# EAGLE design badge2012 (EAGLE 6.2)
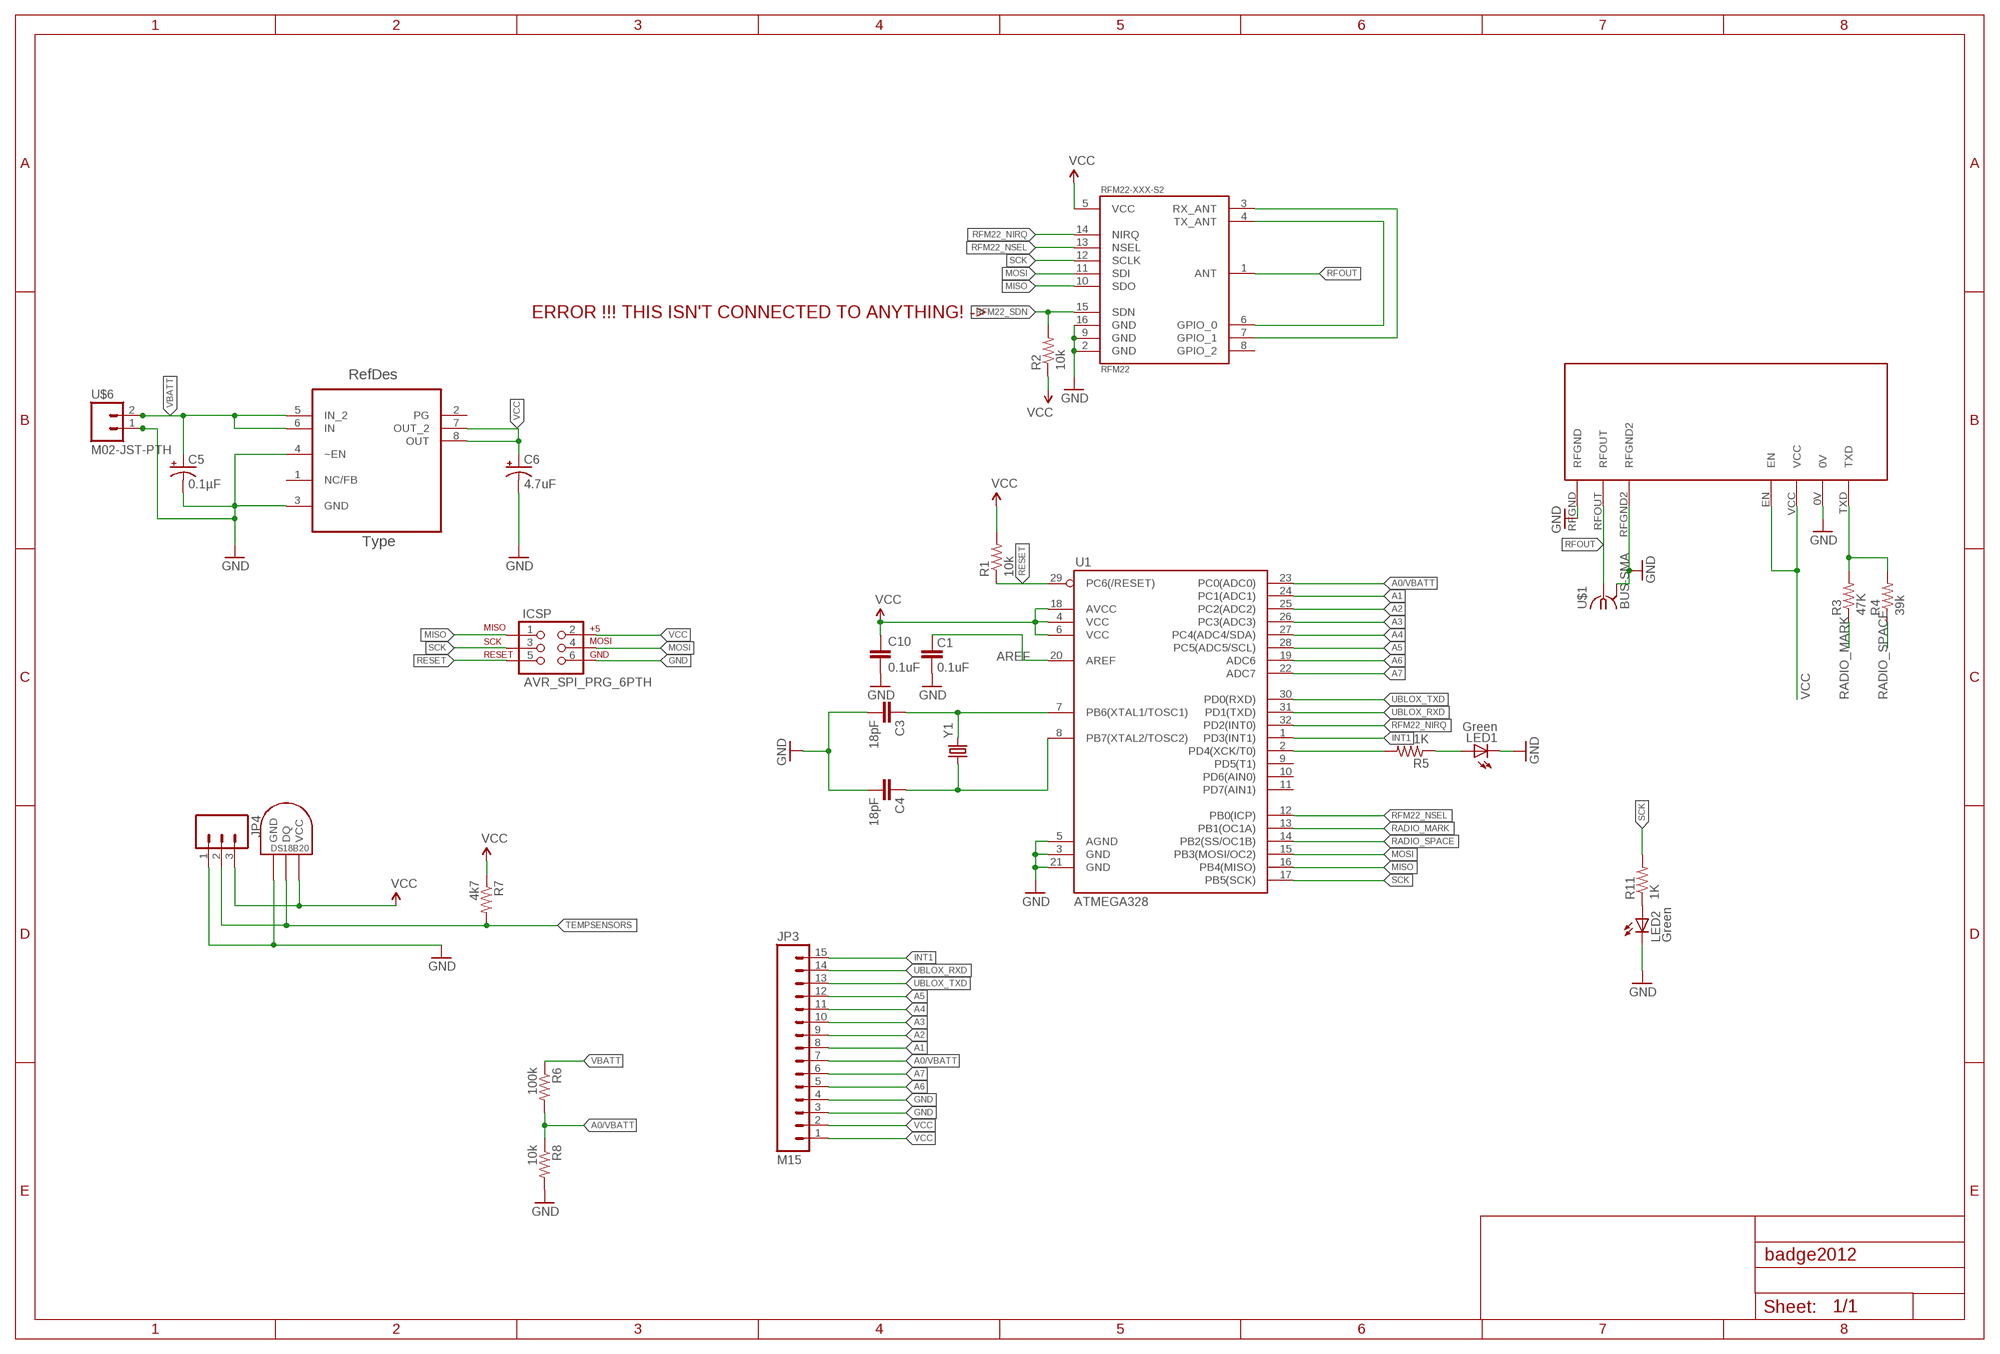
[diagram p0: schematic, sheet 1]

## Parts
C1  0.1uF  CAP0603-CAP  [0603-CAP]
C3  18pF  CAP0603-CAP  [0603-CAP]
C4  18pF  CAP0603-CAP  [0603-CAP]
C5  0.1µF  CAP_POL1206-KIT  [EIA3216-KIT]
C6  4.7uF  CAP_POL1206-KIT  [EIA3216-KIT]
C10  0.1uF  CAP0603-CAP  [0603-CAP]
ICSP  AVR_SPI_PRG_6PTH  [2X3]
JP3  M15  [1X15]
JP4  M03PTH  [1X03]
LED1  Green  LED0603  [LED-0603]
LED2  Green  LED0603  [LED-0603]
NTX2TEMP  DS1821  DS1820SOIC  [DS18B20_SOIC]
R1  10k  RESISTOR0603-RES  [0603-RES]
R2  10k  RESISTOR0603-RES  [0603-RES]
R3  47K  RESISTOR0603-RES  [0603-RES]
R4  39k  RESISTOR0603-RES  [0603-RES]
R5  1K  RESISTOR0603-RES  [0603-RES]
R6  100k  RESISTOR0603-RES  [0603-RES]
R7  4k7  RESISTOR0603-RES  [0603-RES]
R8  10k  RESISTOR0603-RES  [0603-RES]
R11  1K  RESISTOR0603-RES  [0603-RES]
RFM22-XXX-S2  RFM22  [RFM22-XXX-S2]
U1  ATMEGA328  ATMEGA168  [TQFP32-08]
U2  TPS76633D  [SOIC127P600X175-8N]
U$1  BUS-SMA  [BUS-SMA]
U$4  NTX2  [NTX2]
U$6  M02-JST-PTH  [M02-JST-PTH]
Y1  CRYSTALSMD  [HC49UP]

## Nets
A0/VBATT [vcc]: JP3.7 R6.2 R8.1 U1.23(PC0(ADC0))
A1: JP3.8 U1.24(PC1(ADC1))
A2: JP3.9 U1.25(PC2(ADC2))
A3: JP3.10 U1.26(PC3(ADC3))
A4: JP3.11 U1.27(PC4(ADC4/SDA))
A5: JP3.12 U1.28(PC5(ADC5/SCL))
A6: JP3.5 U1.19(ADC6)
A7: JP3.6 U1.22(ADC7)
AREF: C1.2 U1.20(AREF)
GND [vcc]: C1.1 C3.2 C4.2 C5.C(-) C6.C(-) C10.2 ICSP.6 JP3.3 JP3.4 JP4.1 LED1.C LED2.C NTX2TEMP.GND R8.2 RFM22-XXX-S2.2(GND) RFM22-XXX-S2.9(GND) RFM22-XXX-S2.16(GND) U1.3(GND) U1.5(AGND) U1.21(GND) U2.3(GND) U2.4(~EN) U$1.2(GND) U$1.3(GND) U$1.4(GND) U$1.5(GND) U$4.0V U$4.RFGND U$4.RFGND2 U$6.1
INT1: JP3.15 U1.1(PD3(INT1))
MISO: ICSP.1 RFM22-XXX-S2.10(SDO) U1.16(PB4(MISO))
MOSI: ICSP.4 RFM22-XXX-S2.11(SDI) U1.15(PB3(MOSI/OC2))
N$1: R5.2 U1.2(PD4(XCK/T0))
N$2: R3.2 R4.2 U$4.TXD
N$3: LED1.A R5.1
N$5: RFM22-XXX-S2.3(RX_ANT) RFM22-XXX-S2.7(GPIO_1)
N$6: RFM22-XXX-S2.4(TX_ANT) RFM22-XXX-S2.6(GPIO_0)
N$8: LED2.A R11.1
N$9: C3.1 U1.7(PB6(XTAL1/TOSC1)) Y1.2
N$10: C4.1 U1.8(PB7(XTAL2/TOSC2)) Y1.1
RADIO_MARK: R3.1 U1.13(PB1(OC1A))
RADIO_SPACE: R4.1 U1.14(PB2(SS/OC1B))
RESET: ICSP.5 R1.1 U1.29(PC6(/RESET))
RFM22_NIRQ: RFM22-XXX-S2.14(NIRQ) U1.32(PD2(INT0))
RFM22_NSEL: RFM22-XXX-S2.13(NSEL) U1.12(PB0(ICP))
RFM22_SDN: R2.2 RFM22-XXX-S2.15(SDN)
RFOUT: RFM22-XXX-S2.1(ANT) U$1.1 U$4.RFOUT
SCK: ICSP.3 R11.2 RFM22-XXX-S2.12(SCLK) U1.17(PB5(SCK))
TEMPSENSORS: JP4.2 NTX2TEMP.DQ R7.2
UBLOX_RXD: JP3.14 U1.31(PD1(TXD))
UBLOX_TXD: JP3.13 U1.30(PD0(RXD))
VBATT [vcc]: C5.A(+) R6.1 U2.5(IN_2) U2.6(IN) U$6.2
VCC: C6.A(+) C10.1 ICSP.2 JP3.1 JP3.2 JP4.3 NTX2TEMP.VCC R1.2 R2.1 R7.1 RFM22-XXX-S2.5(VCC) U1.4(VCC) U1.6(VCC) U1.18(AVCC) U2.7(OUT_2) U2.8(OUT) U$4.EN U$4.VCC
Unconnected: RFM22-XXX-S2.8(GPIO_2) U1.9(PD5(T1)) U1.10(PD6(AIN0)) U1.11(PD7(AIN1)) U2.1(NC/FB) U2.2(PG)

## Notes on the sheet
- ERROR !!! THIS ISN'T CONNECTED TO ANYTHING! ->

## Library data of the parts
C1 C3 C4 C10 = SparkFun:CAP: Capacitor Standard 0603 ceramic capacitor, and 0.1" leaded capacitor.
C5 C6 = SparkFun:CAP_POL: Capacitor Polarized These are standard SMD and PTH capacitors. Normally 10uF, 47uF, and 100uF in electrolytic and tantalum varieties. Always verify the external diameter of the through hole cap, it varies with capacity, voltage, and manufacturer. The EIA devices should be standard.
ICSP = SparkFun:AVR_SPI_PRG_6: AVR ISP 6 Pin This is the reduced ISP connector for AVR programming. Common on Arduino. This footprint will take up less PCB space and can be used with a 10-pin to 6-pin adapter such as SKU: BOB-08508
JP3 = SparkFun:M15: Header 15 Standard 15-pin 0.1" header. Use with straight break away headers (SKU : PRT-00116), right angle break away headers (PRT-00553), swiss pins (PRT-00743), machine pins (PRT-00117), and female headers (PRT-00115).
JP4 = SparkFun:M03: Header 3 Standard 3-pin 0.1" header. Use with straight break away headers (SKU : PRT-00116), right angle break away headers (PRT-00553), swiss pins (PRT-00743), machine pins (PRT-00117), and female headers (PRT-00115). Molex polarized connector foot print use with SKU : PRT-08232 with associated crimp pins and housings.
LED1 LED2 = SparkFun:LED: LEDs Standard schematic elements and footprints for 5mm, 3mm, 1206, and 0603 sized LEDs. 5mm - Spark Fun Electronics SKU : COM-00529 (and others)
NTX2TEMP = ava:DS1820: DS18B20 Programmable Resolution 1-Wire Digital Thermometer Description The DS18B20 digital thermometer provides 9-bit to 12-bit Celsius temperature measurements and has an alarm function with nonvolatile user-programmable upper and lower trigger points. The DS18B20 communicates over a 1-Wire® bus that by definition requires only one data line (and ground) for communication with a central microprocessor. It has an operating temperature range of -55°C to +125°C and is accurate to ±0.5°C over the range of -10°C to +85°C. In addition, the DS18B20 can derive power directly from the data line ("parasite power"), eliminating the need for an external power supply. Each DS18B20 has a unique 64-bit serial code, which allows multiple DS18B20s to function on the same 1-Wire bus. Thus, it is simple to use one microprocessor to control many DS18B20s distributed over a large area. Applications that can benefit from this feature include HVAC environmental controls, temperature monitoring systems inside buildings, equipment, or machinery, and process monitoring and control systems.
R1-R8 R11 = SparkFun:RESISTOR: Resistor Basic schematic elements and footprints for 0603, 1206, and PTH resistors.
RFM22-XXX-S2 = SparkFun:RFM22: *Hope RF's RFM22* Packages: RFM22-S2 (SMD)
U1 = SparkFun:ATMEGA168
U2 = ava:TPS76633D; DESCRIPTION: ULTRALOW QUIESCENT CURRENT 250-mA LOW DROPOUT VOLTAGE REGULATORS; MPN: TPS76633D; OC_FARNELL: 8461422; OC_NEWARK: 77C1060; PACKAGE: SOIC-8; SUPPLIER: Texas Instruments
U$1 = ava:BUS-SMA
U$4 = ava:NTX2: Radiometrix NTX2 Transmitter Module Author Anthony Stirk / http://ava.upuaut.net
U$6 = ava:M02-JST-PTH
Y1 = SparkFun:CRYSTAL: Crystals Various standard crystals. Proven footprints. Spark Fun Electronics SKU : COM-00534

## Net classes
0 default: width 0.203 mm
1 vcc: width 0.254 mm

## Board
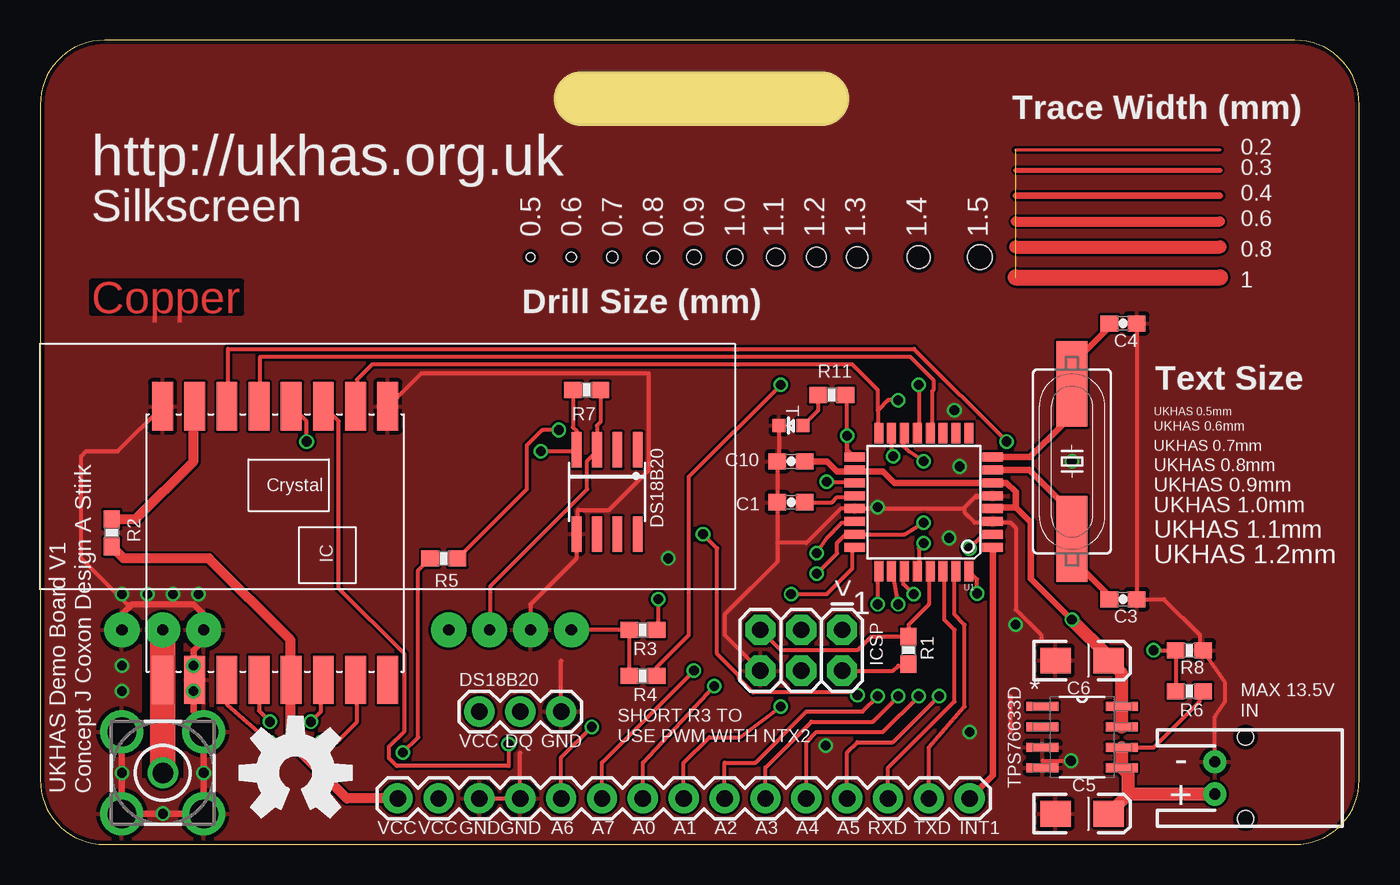
[diagram p1: board, top side]
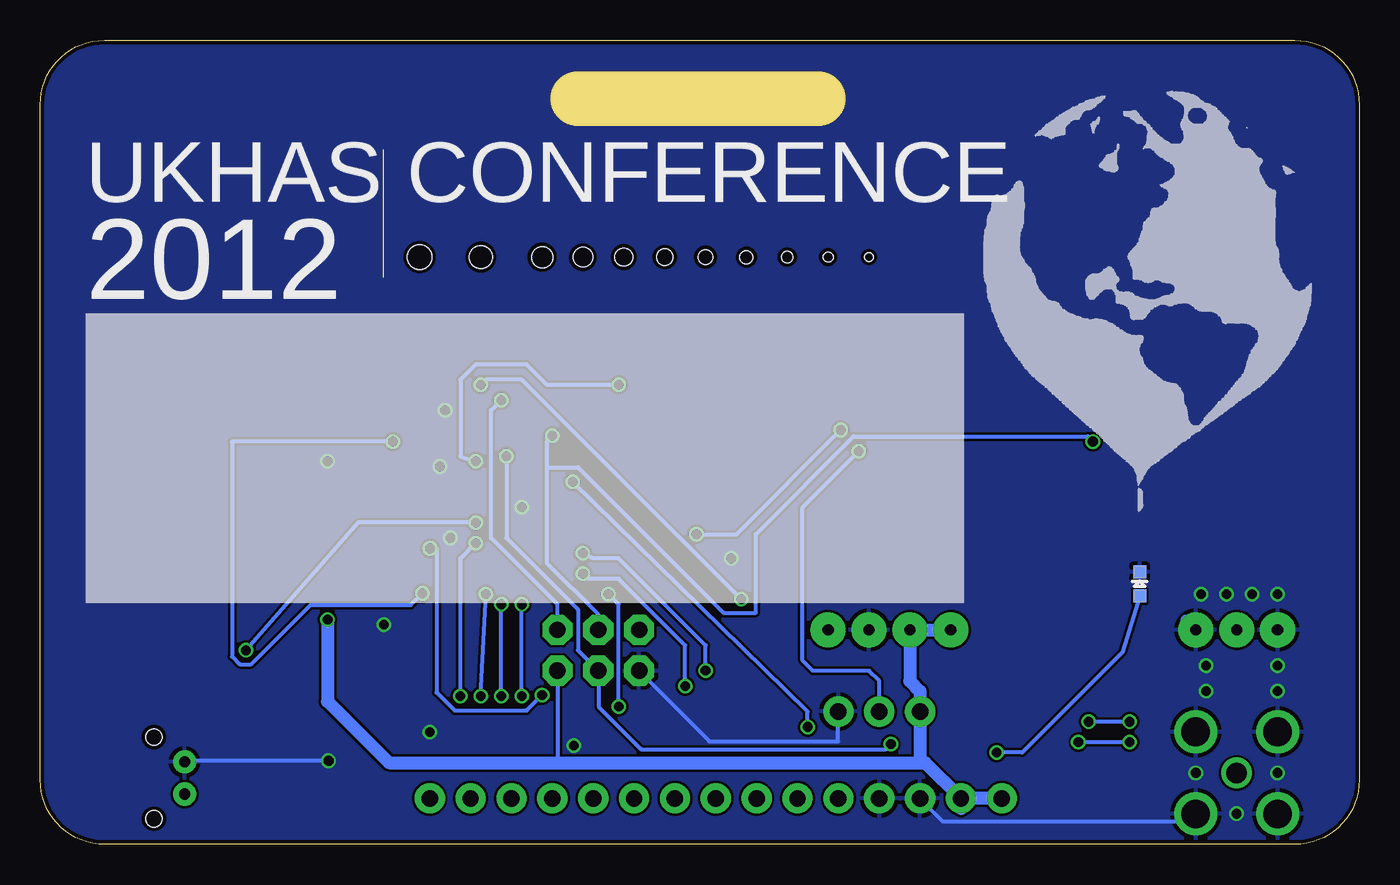
[diagram p2: board, bottom side, seen from below]

Size 82 x 50 mm. Coordinates in mm from the lower left corner, seen from the top.
Outline: 82,4 82,46 arc90 78,50 4,50 arc90 0,46 0,4 arc90 4,0 78,0 arc90 82,4
Copper layers (1*16): Top 0.035mm / dielectric 1.5mm / Bottom 0.035mm
Design rules: minimum track width 6mil, minimum drill 12mil, track to track 6mil, track to pad 6mil, pad to pad 6mil, via to via 6mil, smd to smd 0mil, copper to edge 10mil, drill to drill 10mil, minimum pad ring 10mil, minimum via ring 6mil, stop-mask expansion 2mil, vias tented up to drill 100mil, thermal gap 10mil
Holes 0.5 mm at 30.48,36.51
Holes 0.6 mm at 33.02,36.51
Holes 0.7 mm at 35.56,36.51
Holes 0.8 mm at 38.1,36.51
Holes 0.9 mm at 40.64,36.51
Holes 1 mm at 43.18,36.51
Holes 1.1 mm at 45.72,36.51
Holes 1.2 mm at 48.26,36.51
Holes 1.3 mm at 50.8,36.51
Holes 1.4 mm at 54.61,36.51
Holes 1.5 mm at 58.42,36.51
tRestrict: area 6.3,4.1 to 8.9,13.3
Milling: 1 lines

### Footprints (pad centres in the part's own frame; a part is rotated, then mirrored left to right if it is on the bottom)
0603-CAP = smd 1.1 x 1: 1 -0.85,0; 2 0.85,0
EIA3216-KIT = smd 1.9 x 1.6: A 1.65,0; C -1.65,0
2X3 = drill 1.016 pad 1.88 octagon: 1 0,0; 2 0,2.54; 3 2.54,0; 4 2.54,2.54; 5 5.08,0; 6 5.08,2.54
1X15 = drill 1.016 pad 1.88: 1 0,0; 2 2.54,0; 3 5.08,0; 4 7.62,0; 5 10.16,0; 6 12.7,0; 7 15.24,0; 8 17.78,0; 9 20.32,0; 10 22.86,0; 11 25.4,0; 12 27.94,0; 13 30.48,0; 14 33.02,0; 15 35.56,0
1X03 = drill 1.016 pad 1.88: 1 0,0; 2 2.54,0; 3 5.08,0
LED-0603 = smd 0.8 x 0.8: A 0,-0.75; C 0,0.75
DS18B20_SOIC = smd 0.61 x 2.21: DQ 1.905,-2.616; GND 1.905,2.616; NC -1.905,-2.616; NC2 -0.635,-2.616; NC3 -1.905,2.616; NC4 -0.635,2.616; NC5 0.635,2.616; VCC 0.635,-2.616
0603-RES = smd 1.1 x 1: 1 -0.85,0; 2 0.85,0
RFM22-XXX-S2 = smd 3 x 1.3: 1 -8.5,7; 2 -8.5,5; 3 -8.5,3; 4 -8.5,1; 5 -8.5,-1; 6 -8.5,-3; 7 -8.5,-5; 8 -8.5,-7; 9 8.5,-7; 10 8.5,-5; 11 8.5,-3; 12 8.5,-1; 13 8.5,1; 14 8.5,3; 15 8.5,5; 16 8.5,7
TQFP32-08 = smd 1.27 x 0.559: 1 -4.293,2.8; 2 -4.293,2; 3 -4.293,1.2; 4 -4.293,0.4; 5 -4.293,-0.4; 6 -4.293,-1.2; 7 -4.293,-2; 8 -4.293,-2.8; 17 4.293,-2.8; 18 4.293,-2; 19 4.293,-1.2; 20 4.293,-0.4; 21 4.293,0.4; 22 4.293,1.2; 23 4.293,2; 24 4.293,2.8 | smd 0.559 x 1.27: 9 -2.8,-4.293; 10 -2,-4.293; 11 -1.2,-4.293; 12 -0.4,-4.293; 13 0.4,-4.293; 14 1.2,-4.293; 15 2,-4.293; 16 2.8,-4.293; 25 2.8,4.293; 26 2,4.293; 27 1.2,4.293; 28 0.4,4.293; 29 -0.4,4.293; 30 -1.2,4.293; 31 -2,4.293; 32 -2.8,4.293
SOIC127P600X175-8N = smd 1.981 x 0.559: 1 -2.464,1.905; 2 -2.464,0.635; 3 -2.464,-0.635; 4 -2.464,-1.905; 5 2.464,-1.905; 6 2.464,-0.635; 7 2.464,0.635; 8 2.464,1.905
BUS-SMA = drill 1.27: 1 0,0 | drill 1.778: 2 -2.55,2.55; 3 2.55,2.55; 4 2.55,-2.55; 5 -2.55,-2.55
NTX2 = drill 0.7 pad 2.184: 0V -2.54,-10.16; EN -7.62,-10.16; RFGND -22.86,-10.16; RFGND2 -27.94,-10.16; RFOUT -25.4,-10.16; TXD 0,-10.16; VCC -5.08,-10.16
M02-JST-PTH = drill 0.7 pad 1.448: 1 -1,0; 2 1,0 | hole 1: -2.54,1.905; 2.54,1.905
HC49UP = smd 5.334 x 1.93: 1 -4.826,0; 2 4.826,0

### Placement (x,y rotation side)
C1  46.67,21.27 0 top
C3  67.31,15.24 0 top
C4  67.31,32.38 0 top
C5  64.77,1.91 0 top
C6  64.77,11.43 0 top
C10  46.67,23.81 180 top
ICSP  49.85,13.34 180 top
JP3  22.23,2.86 0 top
JP4  32.38,8.26 180 top
LED1  13.65,16.19 0 bottom
LED2  46.67,26.04 90 top
NTX2TEMP  35.24,21.91 180 top
R1  53.98,12.06 270 top
R2  4.45,19.37 90 top
R3  37.47,13.34 180 top
R4  37.47,10.48 180 top
R5  25.08,17.78 0 top
R6  71.44,9.53 180 top
R7  33.97,28.26 180 top
R8  71.44,12.06 0 top
R11  49.21,27.94 0 top
RFM22-XXX-S2  14.61,18.73 90 top
U1  54.93,21.27 180 top
U2  64.77,6.67 0 top
U$1  7.62,4.45 0 top
U$2  [OSHW-LOGO-L]  15.88,4.45 0 top
U$4  33.02,23.5 0 top
U$6  73.03,4.13 270 top
Y1  64.14,23.81 270 top

### Tracks (layer width: path | path; a pad name or v marks a point on that pad's centre or on a via)
A0/VBATT  (via drill 0.6)
  Top 0.254: R6.2 R8.1 v69.22,12.06 | v54.93,20 53.75,19.27 U1.23 50.54,19.37 50.16,19.37 49.53,18.73 49.53,18.1 v48.26,16.83 | JP3.7 37.47,5.08 v41.91,9.84
  Bottom 0.254: v54.93,20 62.23,20 v69.22,12.06 | v41.91,9.84 41.91,12.38 46.04,16.51 47.94,16.51 v48.26,16.83
A1  (via drill 0.6)
  Top 0.254: JP3.8 40.01,5.08 41.59,6.67 43.5,6.67 v46.04,8.57 | v46.67,15.56 48.9,15.56 50.48,17.14 50.48,18.32 U1.24
  Bottom 0.254: v46.04,8.57 46.04,14.92 v46.67,15.56
A2  (via drill 0.6)
  Top 0.254: v52.07,9.21 51.12,8.26 47.62,8.26 44.45,5.08 42.55,5.08 JP3.9 | v52.07,14.92 52.07,16.92 U1.25
  Bottom 0.254: v52.07,9.21 v52.07,14.92
A3  (via drill 0.6)
  Top 0.254: JP3.10 45.09,4.76 47.94,7.62 51.75,7.62 v53.34,9.21 | v53.34,14.92 53.02,16.89 U1.26
  Bottom 0.254: v53.34,9.21 v53.34,14.92
A4  (via drill 0.6)
  Top 0.254: JP3.11 47.62,6.35 48.26,6.99 52.39,6.99 v54.61,9.21 | v54.29,15.56 53.66,16.19 53.66,16.91 U1.27
  Bottom 0.254: v54.61,9.21 v54.29,15.56
A5  (via drill 0.6)
  Top 0.254: JP3.12 50.16,5.71 50.8,6.35 53.02,6.35 v55.88,9.21 | v54.93,18.73 54.61,18.41 54.61,17.06 U1.28
  Bottom 0.254: v55.88,9.21 55.88,17.78 v54.93,18.73
A6  (via drill 0.6)
  Top 0.254: JP3.5 32.38,5.4 v34.29,7.3 | v48.9,22.54 50.56,22.54 U1.19
  Bottom 0.254: v34.29,7.3 34.29,8.26 v48.9,22.54
A7  (via drill 0.6)
  Top 0.254: JP3.6 34.92,5.08 v40.64,10.79 | v48.26,18.1 48.9,19.05 49.85,20 50.56,20 U1.22
  Bottom 0.254: v40.64,10.79 40.64,12.38 46.04,17.78 47.62,17.78 v48.26,18.1
AREF
  Top 0.254: C1.2 49.21,21.27 49.53,21.59 50.55,21.59 U1.20
GND  (via drill 0.6, 0.61)
  Top 0.254: U$6.1 73.03,7.94 73.66,8.89 73.66,10.06 72.62,11.59 | 72.62,11.59 R8.2 72.07,12.28 72.07,13.02 69.85,15.24 C3.2 C4.2 | 72.66,11.54 72.62,11.59 | LED2.C 45.92,23.91 C10.2 C1.1 45.82,18.73 | 45.82,18.73 45.82,17.57 42.55,14.29 42.55,13.02 ICSP.6 | 45.82,18.73 47.62,18.73 49.77,20.87 U1.21 57.38,20.87 57.47,20.95 | 58.1,21.59 59.14,21.59 U1.5 58.19,21.67 58.1,21.59 | 58.1,21.59 57.47,20.95 | 57.47,20.95 57.47,20.64 58.1,20 59.15,20 | 59.15,20 U1.3 | 59.15,20 60.33,20 60.64,19.68 60.64,14.61 62.23,13.02 62.23,12.7 | 62.87,12.06 62.87,11.69 C6.C 62.55,11.43 | 60.33,9.21 60.33,6.99 | 5.71,14.92 5.4,14.92 2.54,17.78 2.54,24.13 2.86,24.45 4.82,24.45 RFM22-XXX-S2.16 | JP3.3 JP3.4 29.84,5.71 | JP4.1 32.38,11.43 | U$4.0V 30.48,14.92 33.34,17.78 NTX2TEMP.GND 33.44,19.36 33.44,20.8 35.36,20.8 37.84,23.28 37.84,29.28 23.68,29.28 21.68,27.28 RFM22-XXX-S2.9 | 62.31,5.2 v64.08,5.2
  Top 0.406: U$1.2 U$1.5 U$1.4 U$1.3 10.17,7.61 9.53,8.26 9.53,10.15 RFM22-XXX-S2.2 9.53,10.31 9.53,12.06 10.16,12.7 U$4.RFGND 10.16,14.29 9.53,14.92 5.71,14.92 5.08,14.29 U$4.RFGND2
  Bottom 0.254: JP4.1 32.4,8.24 32.4,6.4 40.4,6.4 44.72,10.72 ICSP.6 | v64.08,5.2 72.96,5.2 U$6.1 | U$1.4 10.24,1.84 10.64,1.44 25.92,1.44 27.28,2.8 JP3.3
  Bottom 0.61: 10.79,13.97 U$4.RFGND
  other vias: 57.15,23.5 56.52,19.05 60.64,13.65 52.07,20.95 57.78,6.99 10.16,4.45 7.62,1.91 5.08,4.45 9.53,9.53 5.08,9.53 5.08,11.11 5.08,15.56 6.67,15.56 8.26,15.56 9.84,15.56 9.53,11.11 64.14,23.81 39.05,17.78 48.83,6.14 56.83,26.99
  pour Top: 0,0 82.23,0 82.23,49.85 0,49.85 0,49.21
  pour Bottom: 0,0 82.23,0 82.23,49.85 0,49.85 0,49.21
INT1
  Top 0.406: U1.1 59.22,4.29 JP3.15
MISO  (via drill 0.6)
  Top 0.254: v53.34,27.62 52.7,27.62 52.07,26.99 | 52.07,26.99 52.07,25.62 U1.16 | 52.07,26.99 52.07,28.26 50.48,29.84 20.64,29.84 19.68,28.89 19.68,27.31 RFM22-XXX-S2.10
  Bottom 0.254: ICSP.1 49.85,14.92 53.98,19.05 53.98,26.99 v53.34,27.62
MOSI  (via drill 0.6, 0.61)
  Top 0.254: U1.15 52.93,24.23 v53.02,24.13 | v29.12,6.24 29.12,4.88 22.16,4.88 21.68,5.36 21.68,6.08 22.64,7.04 22.64,11.84 18.56,15.92 18.56,26.32 17.68,27.2 RFM22-XXX-S2.11
  Bottom 0.254: v53.02,24.13 53.02,19.05 48.58,14.61 48.58,12.06 ICSP.4 47.28,10.72 47.28,8.56 44.64,5.92 29.44,5.92 v29.12,6.24
N$1  (via drill 0.61)
  Top 0.254: v32.24,25.76 31.2,25.76 30.24,24.8 30.24,22.08 26,17.84 R5.2 | v41.2,19.28 42.08,18.4 42.08,11.84 43.44,10.48 43.44,10.32 44.32,9.44 50.8,9.44 v50.8,9.28 | v57.76,18.4 58.56,19.2 59.2,19.2 U1.2
  Bottom 0.254: v32.24,25.76 38.72,19.28 v41.2,19.28 | v50.8,9.28 51.76,8.32 56.24,8.32 57.36,9.44 57.36,18.4 v57.76,18.4
N$2
  Top 0.254: U$4.TXD R3.2 R4.2
N$3  (via drill 0.6)
  Top 0.254: v22.54,5.71 23.5,6.67 23.5,17.04 R5.1
  Bottom 0.254: LED1.A 14.72,11.95 20.95,5.71 v22.54,5.71
N$4  (5 unrouted)
  Top 0.2: 60.64,43.18 73.34,43.18
  Top 0.3: 60.64,41.91 73.34,41.91
  Top 0.4: 60.64,40.32 73.34,40.32
  Top 0.61: 60.64,38.73 73.34,38.73
  Top 0.8: 60.64,37.15 73.34,37.15
  Top 1: 60.64,35.24 73.34,35.24
N$5  (via drill 0.6)
  Top 0.254: RFM22-XXX-S2.3 11.61,8.71 v14.29,6.35 | v17.46,6.35 18.41,6.35 19.68,7.62 19.68,10.15 RFM22-XXX-S2.7
  Bottom 0.254: v14.29,6.35 v17.46,6.35
N$6  (via drill 0.6)
  Top 0.254: RFM22-XXX-S2.4 13.61,8.3 v14.29,7.62 | v16.83,7.62 17.46,8.26 17.46,10.09 RFM22-XXX-S2.6
  Bottom 0.254: v14.29,7.62 v16.83,7.62
N$8
  Top 0.254: R11.1 48.36,26.98 LED2.A
N$9
  Top 0.406: U1.7 61.5,23.27 63.5,21.27 63.5,19.62 Y1.2 64.14,17.78 66.46,15.46 C3.1
N$10
  Top 0.406: 63.82,27.62 63.82,28.26 | 63.82,28.26 63.82,28.64 Y1.1 64.14,29.84 66.46,32.17 C4.1 | U1.8 61.54,24.07 63.5,26.04 63.5,27.94 63.82,28.26
RADIO_MARK  (via drill 0.6)
  Top 0.254: 38.31,13.55 R3.1 38.42,13.44 v38.42,15.24 | v54.61,28.57 54.61,25.65 U1.13
  Bottom 0.254: v38.42,15.24 52.07,28.89 54.29,28.89 v54.61,28.57
RADIO_SPACE  (via drill 0.6)
  Top 0.254: R4.1 38.31,11.01 40.32,13.02 40.32,22.86 v46.04,28.57 | v54.93,23.81 53.98,24.45 53.66,24.77 53.66,25.5 U1.14
  Bottom 0.254: v46.04,28.57 50.48,28.57 51.75,29.84 54.93,29.84 55.88,28.89 55.88,24.13 v54.93,23.81
RESET
  Top 0.254: U1.29 55.24,16.9 55.24,14.92 53.98,13.65 R1.1 51.65,12.91 50.8,12.06 46.04,12.06 ICSP.5
RFM22_NIRQ  (via drill 0.61)
  Top 0.254: v58.24,15.6 58.24,16.48 57.76,16.96 U1.32 | v60.08,25.04 54.32,30.8 11.68,30.8 11.68,27.28 RFM22-XXX-S2.14
  Bottom 0.254: v58.24,15.6 58.96,14.88 65.2,14.88 68.88,11.2 69.6,11.2 70.08,11.68 70.08,25.04 v60.08,25.04
RFM22_NSEL
  Top 0.254: U1.12 55.36,25.6 55.44,25.68 55.44,28.16 55.52,28.24 55.52,28.88 54.08,30.32 13.68,30.32 13.68,27.28 RFM22-XXX-S2.13
RFM22_SDN
  Top 0.61: R2.2 5.93,20.22 9.53,23.81 9.53,27.15 RFM22-XXX-S2.15
RFOUT
  Top 1.6: U$4.RFOUT 7.62,10.25 RFM22-XXX-S2.1 7.61,4.46 U$1.1
SCK  (via drill 0.6, 0.61)
  Top 0.254: v50.16,25.4 50.16,24.54 U1.17 50.54,24.07 50.16,24.45 v50.16,25.4 | v50.16,25.4 50.16,27.84 R11.2 | v16.56,25.04 16.56,26.32 15.68,27.2 RFM22-XXX-S2.12
  Bottom 0.254: ICSP.3 47.31,14.29 50.48,17.46 50.48,23.44 | 50.48,23.44 50.48,25.08 v50.16,25.4 | v16.56,25.04 16.88,25.36 31.44,25.36 37.52,19.28 37.52,14.4 39.52,14.4 48.56,23.44 50.48,23.44
TEMPSENSORS  (via drill 0.6)
  Top 0.254: R7.2 33.12,25.93 33.34,25.72 NTX2TEMP.DQ 33.26,24.45 v31.11,24.45
  Bottom 0.254: JP4.2 29.84,10.16 30.48,10.79 33.97,10.79 34.61,11.43 34.61,20.95 v31.11,24.45
UBLOX_RXD
  Top 0.254: JP3.14 55.24,6.03 57.47,8.57 57.47,13.65 56.83,14.29 56.83,16.76 U1.31
UBLOX_TXD
  Top 0.254: JP3.13 52.7,4.76 56.83,8.89 56.83,13.34 56.2,13.97 56.2,16.91 U1.30
VBATT
  Top 0.254: U2.6 69.22,6.03 72.07,8.89 72.07,9.31 R6.1
  Top 0.813: U$6.2 67.64,3.13 | 67.64,3.13 C5.A | 67.64,3.13 67.64,4.35 U2.5 U2.6
VCC  (via drill 0.6)
  Top 0.254: R7.1 34.82,26.25 34.61,26.04 NTX2TEMP.VCC 34.56,24.4 34,23.84 34,22.08 28,16.08 28,13.36 U$4.VCC | ICSP.2 53.02,10.79 53.34,11.11 53.87,11.11 R1.2
  Top 0.406: v64.14,13.97 61.59,16.51 61.59,20 60.64,20.95 | 60.64,20.95 59.3,20.95 U1.4 | 60.64,20.95 60.64,21.91 60.08,22.47 U1.6 53.09,22.47 52.39,23.18 50.73,23.18 U1.18 50.54,23.18 49.53,23.18 48.9,23.81 C10.1
  Top 0.61: JP3.1 19.05,2.86 15.56,6.35 15.56,10.19 | 15.56,10.19 RFM22-XXX-S2.5 | 15.56,10.19 15.56,12.7 10.48,17.78 5.18,17.78 R2.1
  Top 0.813: U2.7 U2.8 67.23,10.62 C6.A 66.42,11.69 v64.14,13.97
  Bottom 0.254: ICSP.2 49.85,5.08 | JP3.2 24.72,2.8 24.45,2.53
  Bottom 0.813: v64.14,13.97 64.14,8.89 60.33,5.08 49.85,5.08 27.3,5.08 | 27.3,5.08 26.99,5.08 JP3.2 | 27.3,5.08 JP4.3 27.3,9.53 27.94,10.16 U$4.VCC U$4.EN | JP3.1 24.13,2.86 24.45,2.53 24.77,2.22

### Text on the board
Top: Copper
tPlace: Trace Width (mm) | 0.2 | http://ukhas.org.uk | 0.3 | 0.4 | Silkscreen | 0.5 | 0.6 | 0.7 | 0.8 | 0.9 | 1.0 | 1.1 | 1.2 | 1.3 | 1.4 | 1.5 | 0.6 | 0.8 | 1 | Drill Size (mm) | Text Size | T | UKHAS 0.5mm | UKHAS 0.6mm | UKHAS 0.7mm | UKHAS 0.8mm | UKHAS 0.9mm | UKHAS 1.0mm | DS18B20 | UKHAS 1.1mm | > | UKHAS 1.2mm | 1 | ICSP | DS18B20 | MAX 13.5V | SHORT R3 TO | IN | VCC | DQ | GND | USE PWM WITH NTX2 | - | UKHAS Demo Board V1 | Concept J Coxon Design A Stirk | TPS76633D | + | VCC | VCC | GND | GND | A6 | A7 | A0 | A1 | A2 | A3 | A4 | A5 | RXD | TXD | INT1
bPlace: UKHAS CONFERENCE | 2012
tStop: Soldermask